# EAGLE schematic teleinfo (EAGLE 6.5.0)
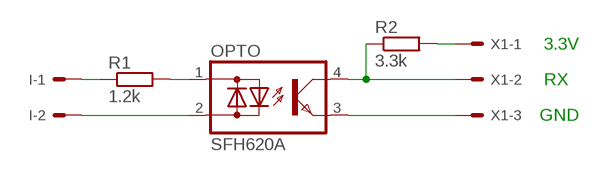
[diagram p0: schematic, sheet 1]

## Parts
I  22-23-2021  [22-23-2021]
OPTO  SFH620A  [DIL04]
R1  1.2k  R-EU_0207/12  [0207/12]
R2  3.3k  R-EU_0207/12  [0207/12]
X1  22-23-2031  [22-23-2031]

## Nets
N$1: OPTO.1(AC1) R1.2
N$2: I.1 R1.1
N$3: I.2 OPTO.2(AC2)
N$4: OPTO.4(C) R2.1 X1.2
N$5: OPTO.3(E) X1.3
N$6: R2.2 X1.1

## Notes on the sheet
- 3.3V
- RX
- GND

## Library data of the parts
I = con-molex:22-23-2021: .100" (2.54mm) Center Header - 2 Pin; MF: MOLEX; MPN: 22-23-2021; OC_FARNELL: 1462926; OC_NEWARK: 25C3832
OPTO = optocoupler:SFH620: Optocoupler, Phototransistor Output, AC Input Source: http://www.vishay.com/docs/83675/sfh620.pdf; MPN: SFH620A-2; OC_FARNELL: 1469594; OC_NEWARK: 97K9546
R1 R2 = resistor:R-EU_: RESISTOR, European symbol
X1 = con-molex:22-23-2031: .100" (2.54mm) Center Header - 3 Pin; MF: MOLEX; MPN: 22-23-2031; OC_FARNELL: 1462950; OC_NEWARK: 30C0862